# Altium schematic sheet Embebidos.SchDoc
size A4
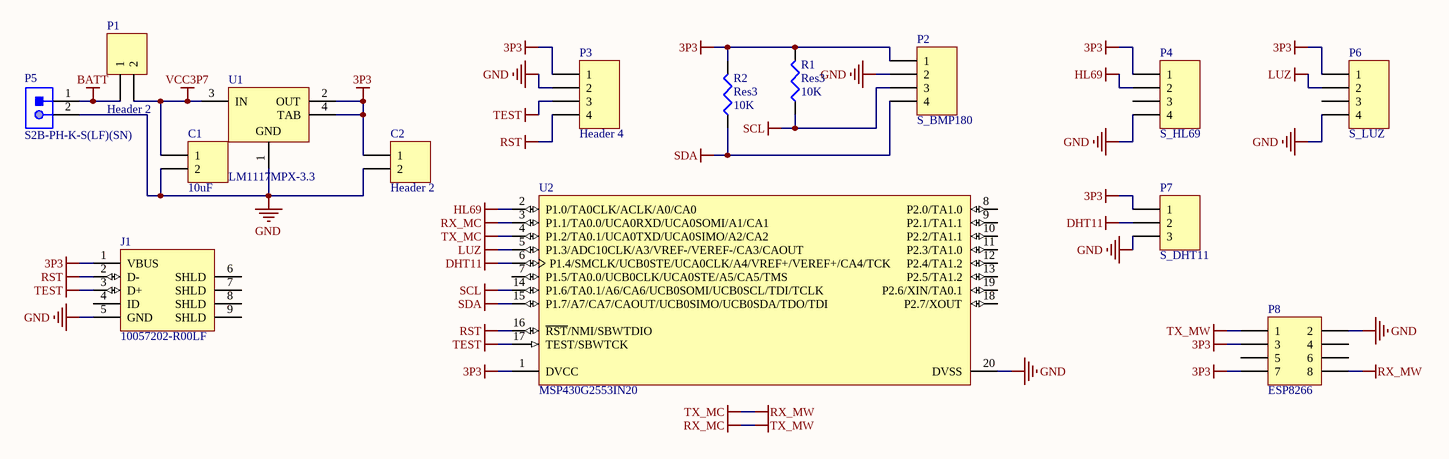
[diagram p0: Embebidos.SchDoc]

## Parts
C1  10uF  [HDR1X2]
C2  Header 2  [HDR1X2]
J1  10057202-R00LF  [FCI-10057202-R00LF_V]
P1  Header 2  [HDR1X2]
P2  S_BMP180  [HDR1X4]
P3  Header 4  [HDR1X4]
P4  S_HL69  [HDR1X4]
P5  S2B-PH-K-S(LF)(SN)  [JST-S2B-PH-K-S_V]
P6  S_LUZ  [HDR1X4]
P7  S_DHT11  [HDR1X3]
P8  ESP8266  [HDR2X4]
R1  Res3  value 10K  [J1-0603]
R2  Res3  value 10K  [J1-0603]
U1  LM1117MPX-3.3  [DCY0004A_N]
U2  MSP430G2553IN20  [N0020A]

## Nets
3P3: C2.1 J1.1(VBUS) P2.1 P3.1 P4.1 P6.1 P7.1 P8.3 P8.7 R1.2 R2.2 U1.2(OUT) U1.4(TAB) U2.1(DVCC)
BATT: P1.1 P5.1
DHT11: P7.2 U2.6(P1.4/SMCLK/UCB0STE/UCA0CLK/A4/VREF+/VEREF+/CA4/TCK)
GND: C1.2 C2.2 J1.5(GND) P2.2 P3.2 P4.4 P5.2 P6.4 P7.3 P8.2 U1.1(GND) U2.20(DVSS)
HL69: P4.2 U2.2(P1.0/TA0CLK/ACLK/A0/CA0)
LUZ: P6.2 U2.5(P1.3/ADC10CLK/A3/VREF-/VEREF-/CA3/CAOUT)
RST: J1.2(D-) P3.4 U2.16(~{RST}/NMI/SBWTDIO)
RX_MC: P8.1 U2.3(P1.1/TA0.0/UCA0RXD/UCA0SOMI/A1/CA1)  [also labelled TX_MW]
RX_MW: P8.8 U2.4(P1.2/TA0.1/UCA0TXD/UCA0SIMO/A2/CA2)  [also labelled TX_MC]
SCL: P2.3 R1.1 U2.14(P1.6/TA0.1/A6/CA6/UCB0SOMI/UCB0SCL/TDI/TCLK)
SDA: P2.4 R2.1 U2.15(P1.7/A7/CA7/CAOUT/UCB0SIMO/UCB0SDA/TDO/TDI)
TEST: J1.3(D+) P3.3 U2.17(TEST/SBWTCK)
VCC3P7: C1.1 P1.2 U1.3(IN)

Not connected (* = marked no-connect by the designer): J1 4(ID) 6(SHLD) 7(SHLD) 8(SHLD) 9(SHLD); P4 3; P6 3; P8 4 5 6; U2 7(P1.5/TA0.0/UCB0CLK/UCA0STE/A5/CA5/TMS) 8(P2.0/TA1.0) 9(P2.1/TA1.1) 10(P2.2/TA1.1) 11(P2.3/TA1.0) 12(P2.4/TA1.2) 13(P2.5/TA1.2) 18(P2.7/XOUT) 19(P2.6/XIN/TA0.1)

## Library data of the parts
C1 C2 P1 = Header 2: Header, 2-Pin; LatestRevisionDate: 17-Jul-2002; LatestRevisionNote: Re-released for DXP Platform.; Publisher: Altium Limited
J1 = CMP-0397-00001-1: Connector Mini USB, Right Angle, Receptacle, Type B; Manufacturer: FCI Electronics; ComponentLink1URL: http://portal.fciconnect.com/; DatasheetVersion: Rev. A, 12/2006; Mounting Technology: Surface Mount; ComponentLink1Description: Manufacturer URL; ComponentLink2Description: Datasheet; ComponentLink2URL: http://portal.fciconnect.com/Comergent//fci/documentation/gs-12-421.pdf; PartNumber: 10057202-R00LF; PackageReference: 10057202-R00LF; PackageDescription: Connector, USB Mini-B, Sinking Type, SMT, 5 Position, Right Angle
P2-P4 P6 = Header 4: Header, 4-Pin; LatestRevisionDate: 17-Jul-2002; LatestRevisionNote: Re-released for DXP Platform.; Publisher: Altium Limited
P5 = CMP-1755-00004-1: Male Header, Pitch 2 mm, 1 x 2 Position, Height 4.8 mm, Tail Length 3.4 mm, -25 to 85 degC, RoHS, Bulk; Case\Package: Radial; Tolerance: 20%; Capacitance: 10 uF; Voltage Rating (DC): 50 V; Packaging: Bulk; ComponentLink1URL: http://www.jst-mfg.com/product/pdf/eng/ePH.pdf; Radiation Hardening: No; Height: 11 mm; Package Quantity: 200; PackageDescription: Male Header, Pitch 2 mm, 1 x 2 Position, Height 4.8 mm, Tail Length 3.4 mm; PackageReference: S2B-PH-K-S; Diameter: 5 mm; Pins: 2; Mount: Through Hole; Max Operating Temperature: 85 degC; Min Operating Temperature: -40 degC; ComponentLink1Description: Datasheet; DatasheetVersion: Dec-12; Length: 11 mm; Lead Pitch: 2 mm; REACH SVHC: No SVHC; Voltage Rating: 50 V; RoHSCompliant: true
P7 = Header 3: Header, 3-Pin; LatestRevisionDate: 17-Jul-2002; LatestRevisionNote: Re-released for DXP Platform.; Publisher: Altium Limited
P8 = Header 4X2: Header, 4-Pin, Dual row; LatestRevisionDate: 17-Jul-2002; LatestRevisionNote: Re-released for DXP Platform.; Publisher: Altium Limited
R1 R2 = Res3: Resistor; Published: 8-Jun-2000; LatestRevisionDate: 29-May-2009; LatestRevisionNote: IPC-7351 Footprint Added.; PackageReference: J1-0603; Publisher: Altium Limited; PackageDescription: Chip Resistor
U1 = CMP-0062-01659-4: 800mA Low-Dropout Linear Regulator, 4-pin SOT-223; Manufacturer: Texas Instruments; PackageTopMarking: XYTT*N05A; High-Reliability: Y; PowerWise: N; CompType: LDO IC; PackageDescription: Molded SOT-223, 6.50 x 3.56 x 1.6mm Body, 4 Lead, 2.3mm Pitch; PackageReference: DCY0004A; ComponentLink1Description: Datasheet URL; PartNumber: LM1117MPX-3.3; RoHS: N; PinCount: 4; Code_IPC: SOT223-4; Code_JEDEC: TO-261-AA; ComponentLink1URL: http://www.ti.com/general/docs/lit/getliterature.tsp?genericPartNumber=LM1117-N&fileType=pdf
U2 = CMP-0365-00184-2: 16 MHz Mixed Signal Microcontroller with 16 KB Flash, 512 B SRAM and 24 GPIOs, -40 to 85 degC, 20-pin DIP (N), Pb-Free (RoHS); Manufacturer: Texas Instruments; USCI_B (I2C & SPI): 1; Temp Sensor: Yes; SubFamily: Value Line; Frequency(MHz): 16; ADC Channels: 8; SRAM(B): 512; ADC: 10-bit SAR; GPIO: 24; Timers - 16-bit: 2; Code_JEDEC: MS-001; Eco-Plan: Pb-Free (RoHS); PartNumber: MSP430G2553IN20; ComponentLink1URL: http://www.ti.com/; PackageVersion: 4040049/E; Comparators: Yes; Watchdog: Yes; ComponentLink2Description: Datasheet; ComponentLink1Description: Manufacturer URL; Mounting Technology: Through Hole; ComponentLink2URL: http://www.ti.com/general/docs/lit/getliterature.tsp?genericPartNumber=MSP430G2553&fileType=pdf; Brown Out Reset: Yes; PackageReference: N0020A; PackageDescription: 20-Pin Plastic In-Line, Body 25.40 x 6.35 mm, Pitch 2.54 mm; ComponentLink3URL: http://www.ti.com/litv/pdf/mpds177g; ComponentLink3Description: Package Specification; Flash(KB): 16; Cap touch I/O: Yes; USCI_A (UART/LIN/IrDA/SPI): 1; DatasheetVersion: SLAS735G